# EAGLE design kuramoto5 (EAGLE 6.1)
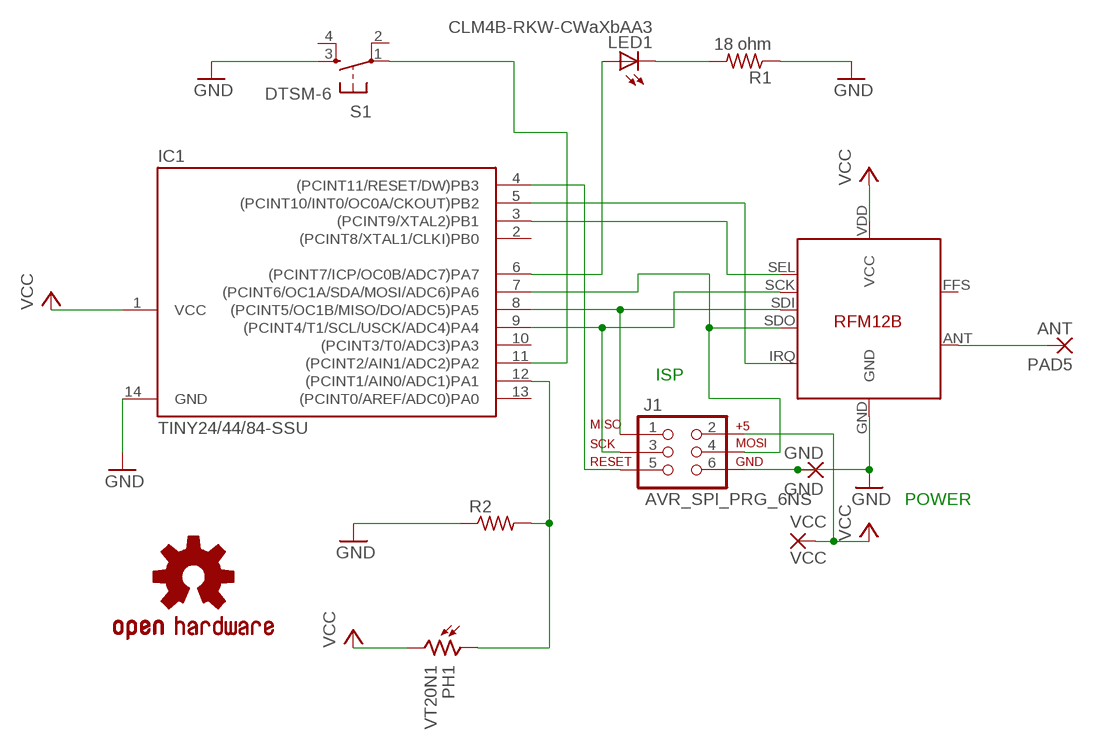
[diagram p0: schematic, sheet 1]

## Parts
GND  GND  WIREPAD2,54/1,0  [2,54/1,0]
IC1  TINY24/44/84-SSU  [SOIC14]
J1  AVR_SPI_PRG_6NS  [2X3-NS]
LED1  CLM4B-RKW-CWaXbAA3  LEDP-LCC-4  [P-LCC-4]
PAD5  ANT  WIREPAD2,54/1,0  [2,54/1,0]
PH1  VT20N1  [TO46-VT200]
R1  18 ohm  R-US_R0805  [R0805]
R2  R-US_R0805  [R0805]
RFM12B  RFM12BN  [RFM12B-NARROW]
S1  DTSM-6  [DTSM-6]
U$1  OSHW-LOGOS  [OSHW-LOGO-S]
VCC  VCC  WIREPAD2,54/1,0  [2,54/1,0]

## Nets
GND: GND.1(P) IC1.14(GND) J1.6 R1.1 R2.1 RFM12B.GND S1.3
N$1: LED1.C@4(C) R1.2
N$2: IC1.9((PCINT4/T1/SCL/USCK/ADC4)PA4) J1.3 RFM12B.SCK
N$3: IC1.8((PCINT5/OC1B/MISO/DO/ADC5)PA5) J1.1 RFM12B.SDI
N$4: IC1.7((PCINT6/OC1A/SDA/MOSI/ADC6)PA6) J1.4 RFM12B.SDO
N$5: IC1.3((PCINT9/XTAL2)PB1) RFM12B.SEL
N$6: IC1.6((PCINT7/ICP/OC0B/ADC7)PA7) LED1.A
N$7: IC1.5((PCINT10/INT0/OC0A/CKOUT)PB2) RFM12B.IRQ
N$8: PAD5.1(P) RFM12B.ANT
N$9: IC1.12((PCINT1/AIN0/ADC1)PA1) PH1.1 R2.2
N$10: IC1.11((PCINT2/AIN1/ADC2)PA2) S1.1
N$14: IC1.4((PCINT11/RESET/DW)PB3) J1.5
VCC: IC1.1(VCC) J1.2 PH1.2 RFM12B.VDD(VCC) VCC.1(P)
Unconnected: IC1.2((PCINT8/XTAL1/CLKI)PB0) IC1.10((PCINT3/T0/ADC3)PA3) IC1.13((PCINT0/AREF/ADC0)PA0) RFM12B.FFS S1.2 S1.4

## Notes on the sheet
- ISP
- POWER

## Library data of the parts
GND PAD5 VCC = wirepad:WIREPAD: Wire PAD connect wire on PCB
IC1 = avr-7:TINY24/44/84
J1 = SparkFun-Connectors:AVR_SPI_PRG_6: AVR ISP 6 Pin This is the reduced ISP connector for AVR programming. Common on Arduino. This footprint will take up less PCB space and can be used with a 10-pin to 6-pin adapter such as SKU: BOB-08508
LED1 = led:LED: LED OSRAM: - CHIPLED LG R971, LG N971, LY N971, LG Q971, LY Q971, LO R971, LY R971 LH N974, LH R974 LS Q976, LO Q976, LY Q976 LO Q996 - Hyper CHIPLED LW Q18S LB Q993, LB Q99A, LB R99A - SideLED LS A670, LO A670, LY A670, LG A670, LP A670 LB A673, LV A673, LT A673, LW A673 LH A674 LY A675 LS A676, LA A676, LO A676, LY A676, LW A676 LS A679, LY A679, LG A679 - Hyper Micro SIDELED® LS Y876, LA Y876, LO Y876, LY Y876 LT Y87S - SmartLED LW L88C, LW L88S LB L89C, LB L89S, LG L890 LS L89K, LO L89K, LY L89K LS L896, LA L896, LO L896, LY L896 - TOPLED LS T670, LO T670, LY T670, LG T670, LP T670 LSG T670, LSP T670, LSY T670, LOP T670, LYG T670 LG T671, LOG T671, LSG T671 LB T673, LV T673, LT T673, LW T673 LH T674 LS T676, LA T676, LO T676, LY T676, LB T676, LH T676, LSB T676, LW T676 LB T67C, LV T67C, LT T67C, LS T67K, LO T67K, LY T67K, LW E67C LS E67B, LA E67B, LO E67B, LY E67B, LB E67C, LV E67C, LT E67C LW T67C LS T679, LY T679, LG T679 LS T770, LO T770, LY T770, LG T770, LP T770 LB T773, LV T773, LT T773, LW T773 LH T774 LS E675, LA E675, LY E675, LS T675 LS T776, LA T776, LO T776, LY T776, LB T776 LHGB T686 LT T68C, LB T68C - Hyper Mini TOPLED® LB M676 - Mini TOPLED Santana® LG M470 LS M47K, LO M47K, LY M47K Source: http://www.osram.convergy.de LUXEON: - LUMILED® LXK2-PW12-R00, LXK2-PW12-S00, LXK2-PW14-U00, LXK2-PW14-V00 LXK2-PM12-R00, LXK2-PM12-S00, LXK2-PM14-U00 LXK2-PE12-Q00, LXK2-PE12-R00, LXK2-PE12-S00, LXK2-PE14-T00, LXK2-PE14-U00 LXK2-PB12-K00, LXK2-PB12-L00, LXK2-PB12-M00, LXK2-PB14-N00, LXK2-PB14-P00, LXK2-PB14-Q00 LXK2-PR12-L00, LXK2-PR12-M00, LXK2-PR14-Q00, LXK2-PR14-R00 LXK2-PD12-Q00, LXK2-PD12-R00, LXK2-PD12-S00 LXK2-PH12-R00, LXK2-PH12-S00 LXK2-PL12-P00, LXK2-PL12-Q00, LXK2-PL12-R00 Source: www.luxeon.com KINGBRIGHT: KA-3528ASYC Source: www.kingbright.com
PH1 = photo-elements:VT2*: Photoconductive Cell VT200 Series Source: http://optoelectronics.perkinelmer.com/content/Datasheets/DTS_vt200seriesdatasheet.pdf
R1 R2 = resistor:R-US_: RESISTOR, American symbol
RFM12B = JeeLabs:RFM12B
S1 = switch-tact:DTSM-6
U$1 = sfe-aesthetics:OSHW-LOGO: Open Source Hardware Logo This logo indicates the piece of hardware it is found on incorporates a OSHW license and/or adheres to the definition of open source hardware found here: http://freedomdefined.org/OSHW

## Board
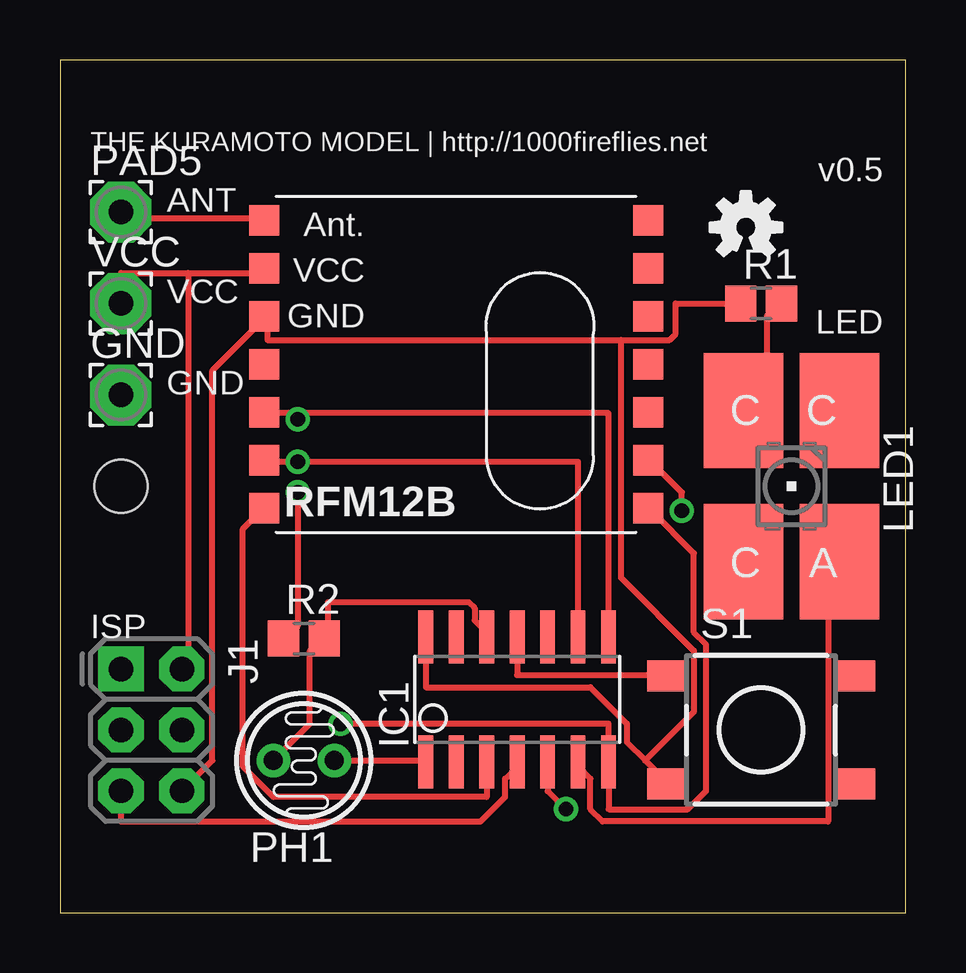
[diagram p1: board, top side]
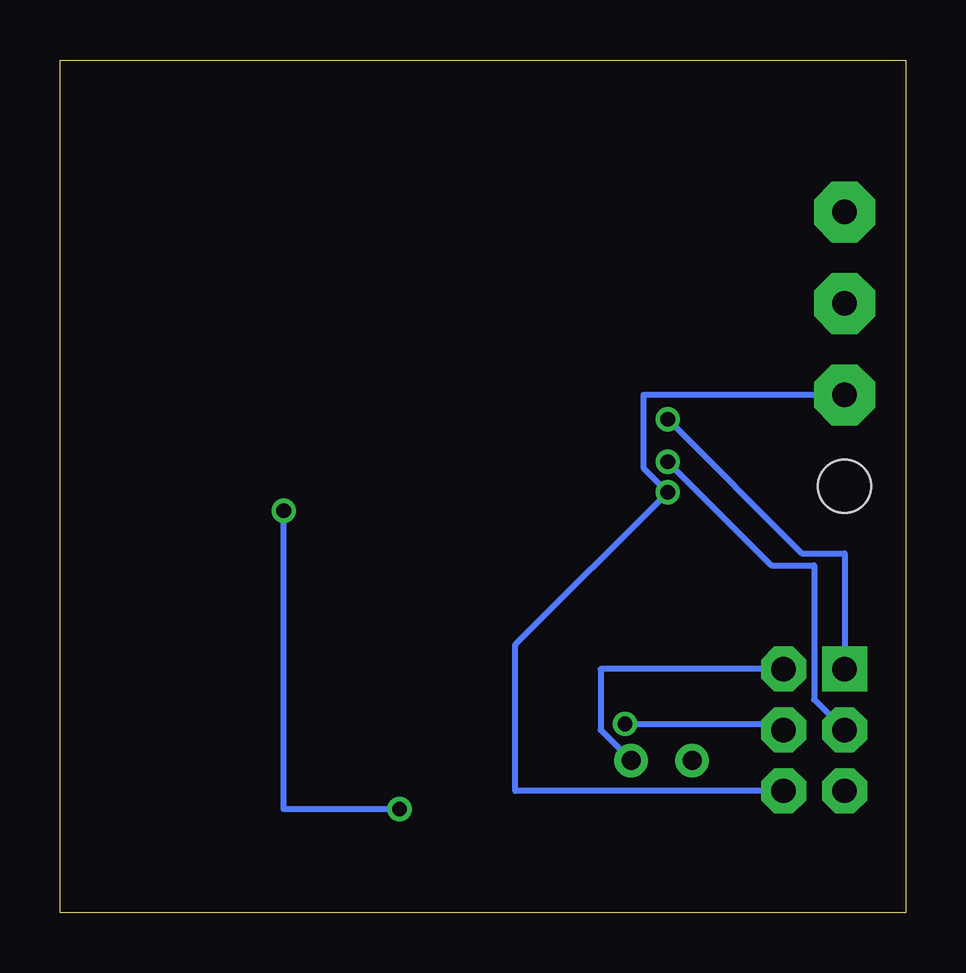
[diagram p2: board, bottom side, seen from below]

Size 35.23 x 35.55 mm. Coordinates in mm from the lower left corner, seen from the top.
Outline: 0,0 35.23,0 35.23,35.55 0,35.55 0,0
Copper layers (1*16): Top 0.035mm / dielectric 1.5mm / Bottom 0.035mm
Design rules: minimum track width 10mil, minimum drill 24mil, track to track 8mil, track to pad 8mil, pad to pad 8mil, via to via 8mil, smd to smd 8mil, copper to edge 40mil, drill to drill 8mil, minimum pad ring 10mil, minimum via ring 8mil, stop-mask expansion 4mil, vias tented up to drill 0mil, thermal gap 10mil
Holes 2.2 mm at 2.54,17.78

### Footprints (pad centres in the part's own frame; a part is rotated, then mirrored left to right if it is on the bottom)
2,54/1,0 = drill 1.016 pad 2.54 octagon: 1 0,0
SOIC14 = smd 0.61 x 2.21: 1 -3.81,-2.603; 2 -2.54,-2.603; 3 -1.27,-2.603; 4 0,-2.603; 5 1.27,-2.603; 6 2.54,-2.603; 7 3.81,-2.603; 8 3.81,2.603; 9 2.54,2.603; 10 1.27,2.603; 11 0,2.603; 12 -1.27,2.603; 13 -2.54,2.603; 14 -3.81,2.603
2X3-NS = drill 1.016 pad 1.88 square: 1 -2.54,-1.27 | drill 1.016 pad 1.88 octagon: 2 -2.54,1.27; 3 0,-1.27; 4 0,1.27; 5 2.54,-1.27; 6 2.54,1.27
P-LCC-4 = smd 3.3 x 4.8: A -2,3.15; C@1 -2,-3.15; C@3 2,3.15; C@4 2,-3.15
TO46-VT200 = drill 0.8 pad 1.4: 1 -1.27,0; 2 1.27,0
R0805 = smd 1.3 x 1.5: 1 -0.85,0; 2 0.85,0
RFM12B-NARROW = smd 1.27 x 1.27: ANT 8,-6; FFS -8,2; GND 8,-2; IRQ -8,4; P$8 -8,0; P$9 -8,-2; P$10 -8,-4; P$12 -8,-6; P$16 8,0; SCK 8,4; SDI 8,2; SDO -8,6; SEL 8,6; VDD 8,-4
DTSM-6 = smd 1.55 x 1.3: 1 -3.975,2.25; 2 3.975,2.25; 3 -3.975,-2.25; 4 3.975,-2.25

### Placement (x,y rotation side)
GND  2.54,21.59 0 top
IC1  19.05,8.89 0 top
J1  3.81,7.62 270 top
LED1  30.48,17.78 180 top
PAD5  2.54,29.21 0 top
PH1  10.16,6.35 0 top
R1  29.21,25.4 0 top
R2  10.16,11.43 0 top
RFM12B  16.51,22.86 180 top
S1  29.21,7.62 0 top
U$1  28.57,28.57 0 top
VCC  2.54,25.4 0 top

### Tracks (layer width: path | path; a pad name or v marks a point on that pad's centre or on a via)
GND  (via drill 0.61)
  Top 0.254: v9.91,17.53 9.91,11.94 9.4,11.43 R2.1 | 24.38,6.35 23.62,7.11 23.62,7.87 22.1,9.4 15.24,9.4 IC1.14 | 24.38,6.35 25.15,5.59 S1.3 | 8.64,24.89 RFM12B.GND | J1.6 6.35,6.35 6.35,22.61 8.38,24.64 RFM12B.GND | R1.1 25.65,25.4 25.65,24.13 25.4,23.88 23.37,23.88 | 23.37,23.88 8.64,23.88 8.64,24.64 RFM12B.GND | 24.38,6.35 26.42,8.38 26.42,10.92 23.37,13.97 23.37,23.88
  Bottom 0.254: GND.1 10.92,21.59 10.92,18.54 v9.91,17.53 16.26,11.18 16.26,5.08 J1.6
N$1
  Top 0.254: R1.2 29.97,25.4 29.46,24.89 29.46,21.84 28.7,21.08 LED1.C@4
N$2  (via drill 0.61)
  Top 0.254: IC1.9 21.59,18.8 v9.91,18.8 8.64,18.8 RFM12B.SCK
  Bottom 0.254: J1.3 3.81,8.89 3.81,14.48 5.59,14.48 v9.91,18.8
N$3  (via drill 0.61)
  Top 0.254: 9.91,20.83 22.86,20.83 IC1.8 | 9.91,20.83 8.64,20.83 RFM12B.SDI | 9.91,20.83 v9.91,20.57
  Bottom 0.254: J1.1 2.54,14.99 4.32,14.99 v9.91,20.57
N$4  (via drill 0.61)
  Top 0.254: RFM12B.SDO 24.64,16.76 26.42,14.99 26.42,11.68 26.92,11.18 26.92,5.08 26.16,4.32 22.86,4.32 IC1.7 22.86,7.87 v11.68,7.87
  Bottom 0.254: J1.4 5.33,7.87 v11.68,7.87
N$5
  Top 0.254: IC1.3 17.78,4.83 8.89,4.83 7.62,6.1 7.62,16 8.38,16.76 RFM12B.SEL
N$6
  Top 0.254: IC1.6 21.59,6.1 22.1,5.59 22.1,4.32 22.61,3.81 32,3.81 32,14.22 32.26,14.48 LED1.A
N$7  (via drill 0.61)
  Top 0.254: v25.91,16.76 25.91,17.53 24.64,18.8 RFM12B.IRQ | v21.08,4.32 20.32,5.08 IC1.5
  Bottom 0.254: v25.91,16.76 25.91,4.32 v21.08,4.32
N$8
  Top 0.254: PAD5.1 2.54,28.96 8.38,28.96 RFM12B.ANT
N$9
  Top 0.254: PH1.1 10.41,7.87 10.41,10.92 10.92,11.43 R2.2 11.18,11.43 11.18,12.95 17.02,12.95 17.27,12.7 17.27,12.19 17.78,11.68 IC1.12
N$10
  Top 0.254: IC1.11 19.05,9.91 25.15,9.91 S1.1
N$14
  Top 0.254: J1.5 2.54,3.81 17.53,3.81 18.54,4.83 18.54,5.59 19.05,6.1 IC1.4
VCC
  Top 0.254: PH1.2 15.24,6.35 IC1.1 | 8.64,26.92 RFM12B.VDD 8.38,26.67 5.33,26.67 | 5.33,26.67 2.54,26.67 VCC.1 | J1.2 5.33,10.41 5.33,26.67
  Bottom 0.254: PH1.2 12.7,7.62 12.7,10.16 J1.2

### Text on the board
tPlace: THE KURAMOTO MODEL | http://1000fireflies.net | v0.5 | ANT | VCC | LED | GND | ISP